# EAGLE schematic improved_circuit_rev3 (EAGLE 7.5.0)

## Sheet 1 of 6
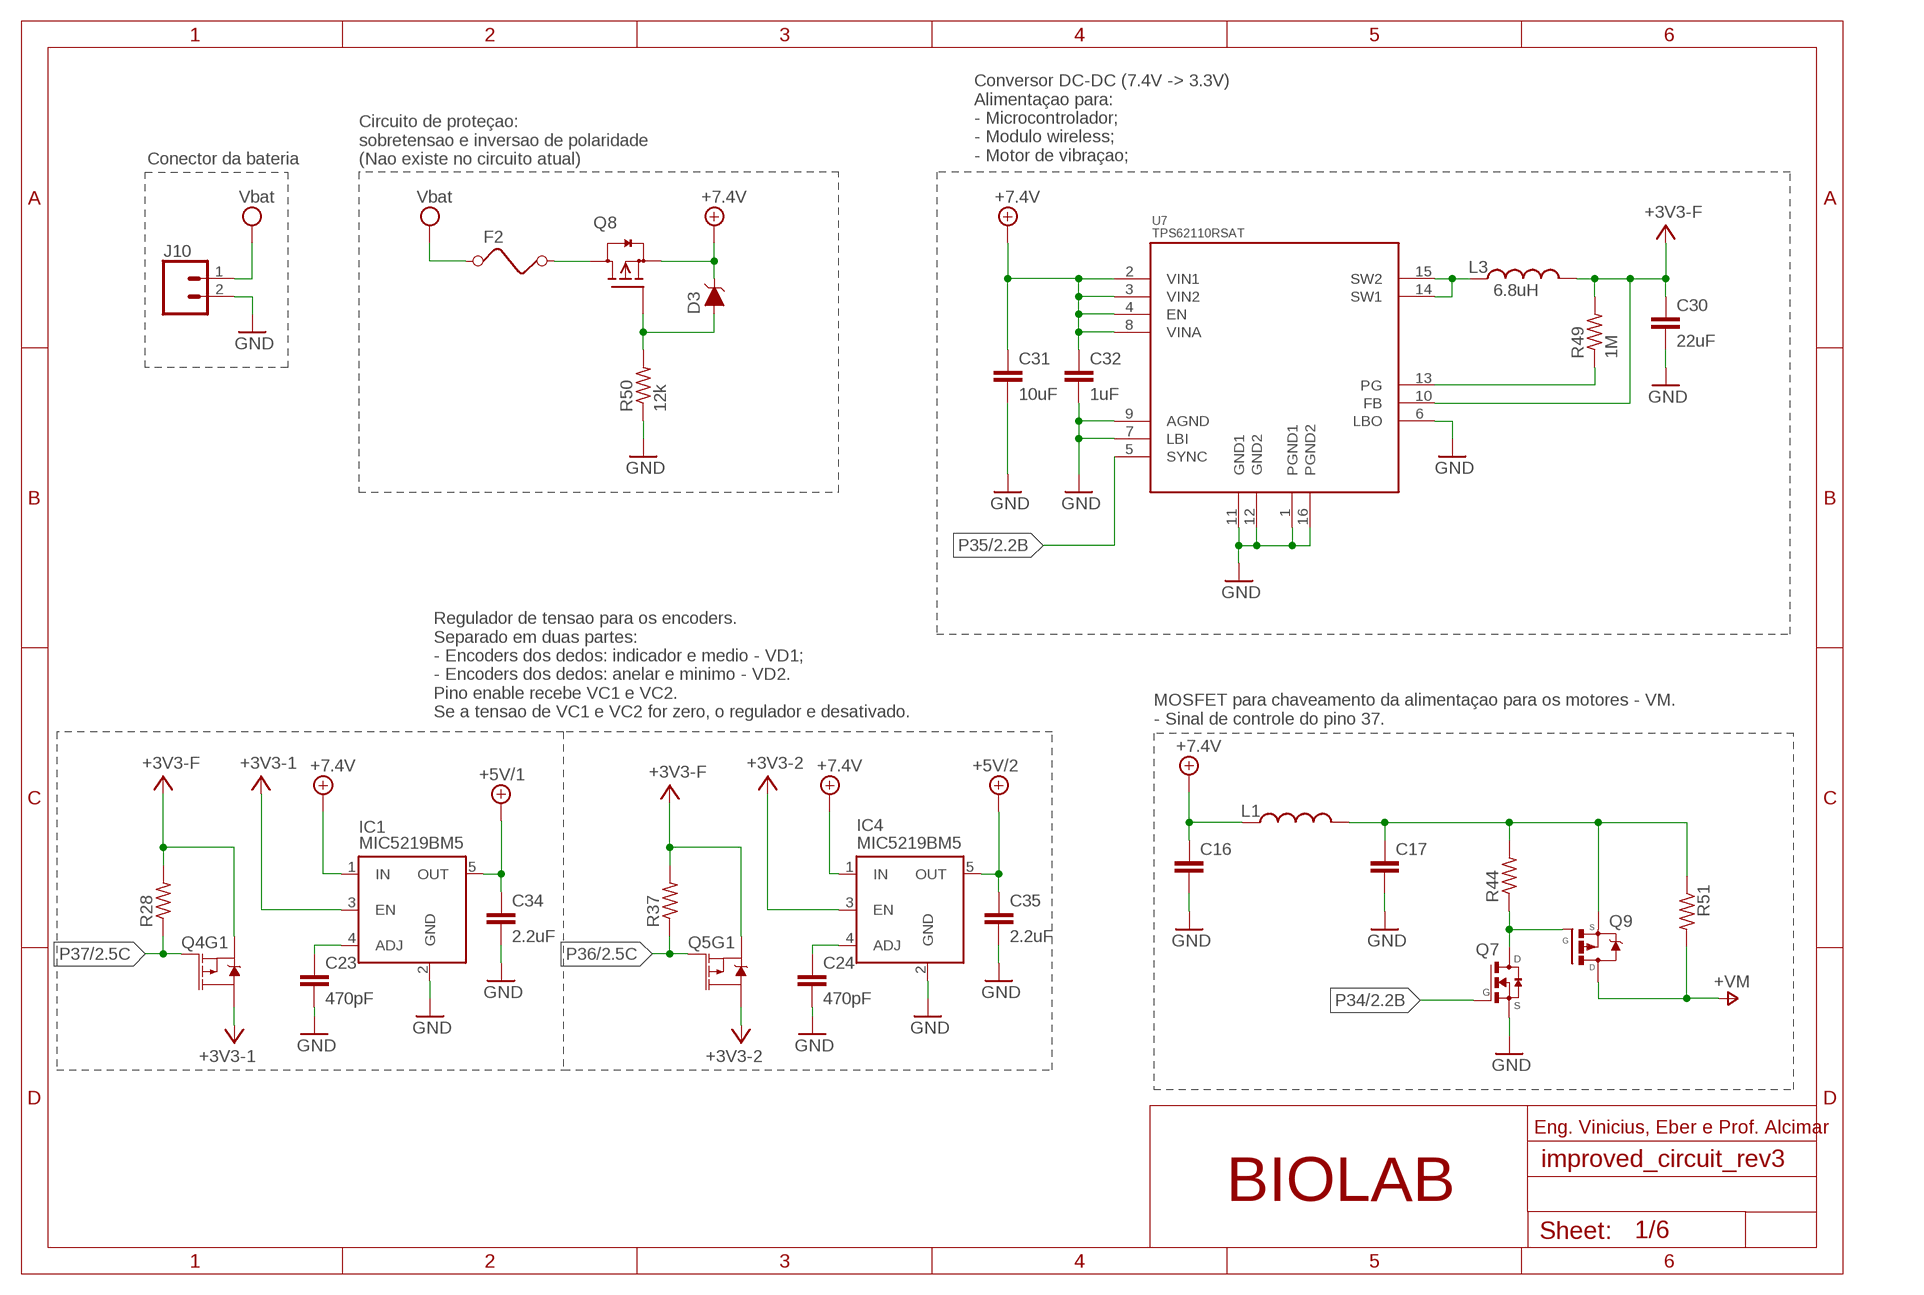
[diagram p0: schematic, sheet 1]

### Parts
C16  C-EUC0805  [C0805]
C17  C-EUC0805  [C0805]
C23  470pF  CAPACITOR_0805_M  [RESC0805_M]
C24  470pF  CAPACITOR_0805_M  [RESC0805_M]
C30  22uF  CAPACITOR_0805_M  [RESC0805_M]
C31  10uF  CAPACITOR_0805_M  [RESC0805_M]
C32  1uF  CAPACITOR_0805_M  [RESC0805_M]
C34  2.2uF  CAPACITOR_0805_M  [RESC0805_M]
C35  2.2uF  CAPACITOR_0805_M  [RESC0805_M]
D3  3.6V  DIODE-ZENER-BZT52C3V6S  [SOD-323]
F2  FUSEF  [1812]
IC1  MIC5219BM5  [SOT23-5]
IC4  MIC5219BM5  [SOT23-5]
J10  CONN_02-JST-2MM-SMT  [JST-2-SMD]
L1  INDUCTOR  [L0603]
L3  6.8uH  INDUCTOR  [L0603]
Q4  2A/20V/150mΩ  MOSFET_PCH_DUAL-DMP2240UDM  [SOT26]
Q5  2A/20V/150mΩ  MOSFET_PCH_DUAL-DMP2240UDM  [SOT26]
Q7  FDV303N  [SOT23]
Q8  BSS84LT1  [SOT23]
Q9  FDS6675  [SO08-E3]
R28  R-US_M0805  [M0805]
R37  R-US_M0805  [M0805]
R44  R-US_M0805  [M0805]
R49  1M  R-US_M0805  [M0805]
R50  12k  R-US_M0805  [M0805]
R51  R-US_M0805  [M0805]
U7  TPS62110RSAT  [QFN16]

### Nets
+3V3: C30.1 IC1.3(EN) IC4.3(EN) L3.2 Q4.S1(S) Q5.S1(S) R28.2 R37.2 R49.2 U7.10(FB) ; supply symbol labelled +3V3-F, +3V3-1, +3V3-2 ; also sheet 2,3,4,5,6
+3V3-1: Q4.D1(D) ; also sheet 4
+3V3-2: Q5.D1(D) ; also sheet 4
+5V/1: C34.1 IC1.5(OUT) ; also sheet 3,4
+5V/2: C35.1 IC4.5(OUT) ; also sheet 4
+7V: C16.1 C31.1 C32.1 D3.C IC1.1(IN) IC4.1(IN) L1.1 Q8.2(S) U7.2(VIN1) U7.3(VIN2) U7.4(EN) U7.8(VINA) ; supply symbol labelled +7.4V ; also sheet 2
GND: C16.2 C17.2 C23.2 C24.2 C30.2 C31.2 C32.2 C34.2 C35.2 IC1.2(GND) IC4.2(GND) J10.2 Q7.2(S) R50.1 U7.1(PGND1) U7.6(LBO) U7.7(LBI) U7.9(AGND) U7.11(GND1) U7.12(GND2) U7.16(PGND2) ; also sheet 2,3,4,5,6
N$9: C17.1 L1.2 Q9.1-3(S) R44.2 R51.1
N$10: Q7.3(D) Q9.4(G) R44.1
N$11: C24.1 IC4.4(ADJ)
N$12: C23.1 IC1.4(ADJ)
N$14: L3.1 U7.14(SW1) U7.15(SW2)
N$15: R49.1 U7.13(PG)
N$16: D3.A Q8.1(G) R50.2
N$18: F2.2 Q8.3(D)
P34: Q7.1(G) ; also sheet 2
P35: U7.5(SYNC) ; also sheet 2
P36: Q5.G1(G) R37.1 ; also sheet 2
P37: Q4.G1(G) R28.1 ; also sheet 2
V+: Q9.5-8(D) R51.2 ; supply symbol labelled +VM ; also sheet 3,4
VCC: F2.1 J10.1 ; supply symbol labelled Vbat
Unconnected: Q4.D2(D) Q4.G2(G) Q4.S2(S) Q5.D2(D) Q5.G2(G) Q5.S2(S)

### Notes on the sheet
- Conversor DC-DC (7.4V -> 3.3V) 
  Alimentaçao para:
  - Microcontrolador;
  - Modulo wireless;
  - Motor de vibraçao;
- Conector da bateria
- Circuito de proteçao: 
  sobretensao e inversao de polaridade
  (Nao existe no circuito atual)
- Regulador de tensao para os encoders.
  Separado em duas partes:
  - Encoders dos dedos: indicador e medio - VD1;
  - Encoders dos dedos: anelar e minimo - VD2.
  Pino enable recebe VC1 e VC2.
  Se a tensao de VC1 e VC2 for zero, o regulador e desativado.
- MOSFET para chaveamento da alimentaçao para os motores - VM.
  - Sinal de controle do pino 37.
- Eng. Vinicius, Eber e Prof. Alcimar
- BIOLAB

## Sheet 2 of 6
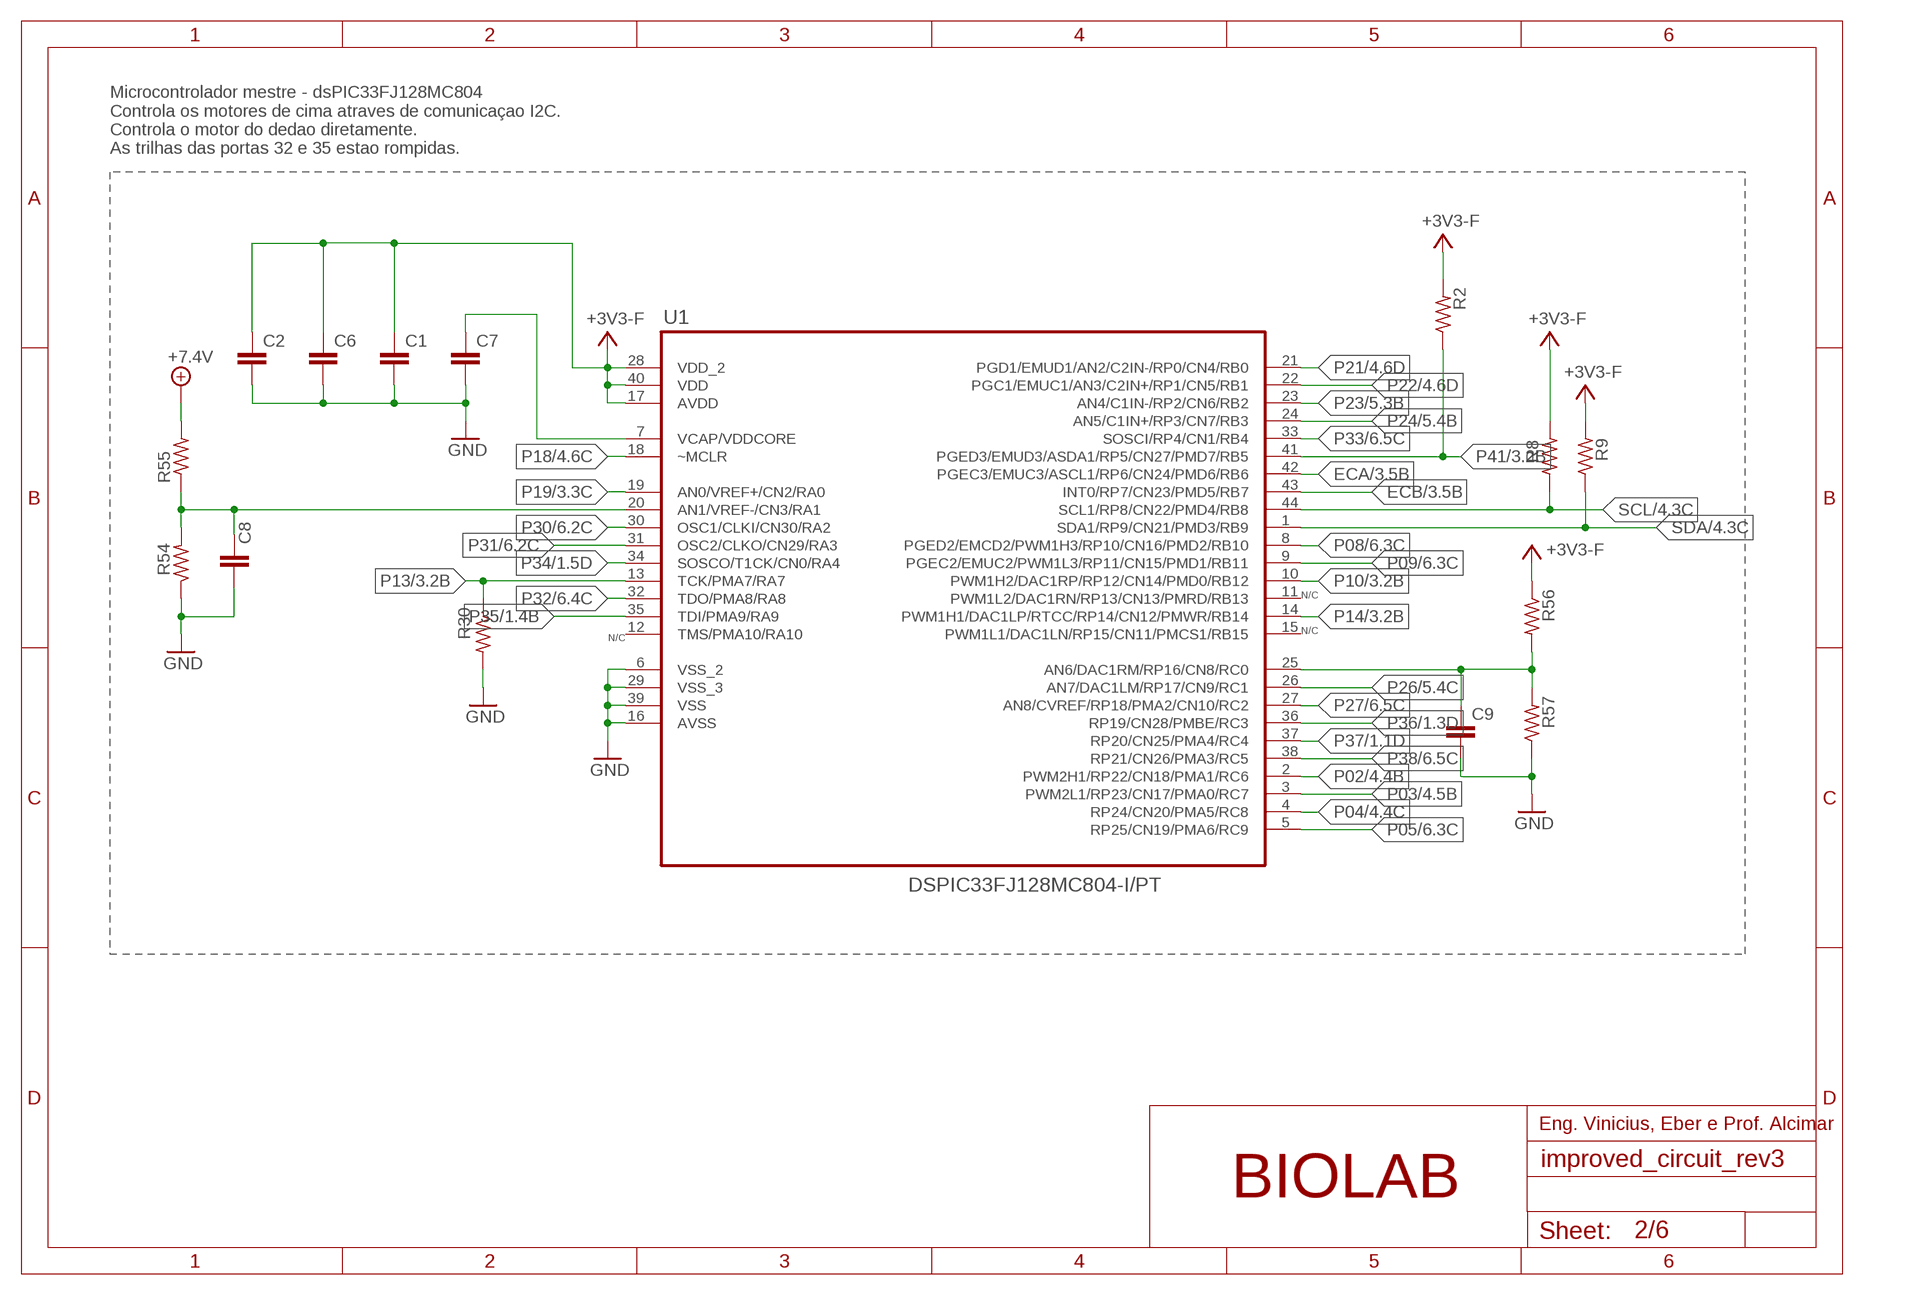
[diagram p1: schematic, sheet 2]

### Parts
C1  CAPACITOR_0805_M  [RESC0805_M]
C2  CAPACITOR_0805_M  [RESC0805_M]
C6  CAPACITOR_0805_M  [RESC0805_M]
C7  CAPACITOR_0805_M  [RESC0805_M]
C8  CAPACITOR_0805_M  [RESC0805_M]
C9  CAPACITOR_0805_M  [RESC0805_M]
R2  R-US_M0805  [M0805]
R8  R-US_M0805  [M0805]
R9  R-US_M0805  [M0805]
R30  R-US_M0805  [M0805]
R54  R-US_M0805  [M0805]
R55  R-US_M0805  [M0805]
R56  R-US_M0805  [M0805]
R57  R-US_M0805  [M0805]
U1  DSPIC33FJ128MC804-I/PT  [QFP80P1200X1200X120-44N]

### Nets
+3V3: C1.1 C2.1 C6.1 R2.2 R8.2 R9.2 R56.1 U1.17(AVDD) U1.28(VDD_2) U1.40(VDD) ; supply symbol labelled +3V3-F ; also sheet 1,3,4,5,6
+7V: R55.2 ; supply symbol labelled +7.4V ; also sheet 1
ECA: U1.42(PGEC3/EMUC3/ASCL1/RP6/CN24/PMD6/RB6) ; also sheet 3
ECB: U1.43(INT0/RP7/CN23/PMD5/RB7) ; also sheet 3
GND: C1.2 C2.2 C6.2 C7.2 C8.2 C9.2 R30.2 R54.1 R57.1 U1.6(VSS_2) U1.16(AVSS) U1.29(VSS_3) U1.39(VSS) ; also sheet 1,3,4,5,6
N$3: C7.1 U1.7(VCAP/VDDCORE)
N$4: C9.1 R56.2 R57.2 U1.25(AN6/DAC1RM/RP16/CN8/RC0)
N$19: C8.1 R54.2 R55.1 U1.20(AN1/VREF-/CN3/RA1)
P02: U1.2(PWM2H1/RP22/CN18/PMA1/RC6) ; also sheet 4
P03: U1.3(PWM2L1/RP23/CN17/PMA0/RC7) ; also sheet 4
P04: U1.4(RP24/CN20/PMA5/RC8) ; also sheet 4
P05: U1.5(RP25/CN19/PMA6/RC9) ; also sheet 6
P08: U1.8(PGED2/EMCD2/PWM1H3/RP10/CN16/PMD2/RB10) ; also sheet 6
P09: U1.9(PGEC2/EMUC2/PWM1L3/RP11/CN15/PMD1/RB11) ; also sheet 6
P10: U1.10(PWM1H2/DAC1RP/RP12/CN14/PMD0/RB12) ; also sheet 3
P13: R30.1 U1.13(TCK/PMA7/RA7) ; also sheet 3
P14: U1.14(PWM1H1/DAC1LP/RTCC/RP14/CN12/PMWR/RB14) ; also sheet 3
P18: U1.18(~MCLR) ; also sheet 4
P19: U1.19(AN0/VREF+/CN2/RA0) ; also sheet 3
P21: U1.21(PGD1/EMUD1/AN2/C2IN-/RP0/CN4/RB0) ; also sheet 4
P22: U1.22(PGC1/EMUC1/AN3/C2IN+/RP1/CN5/RB1) ; also sheet 4
P23: U1.23(AN4/C1IN-/RP2/CN6/RB2) ; also sheet 5
P24: U1.24(AN5/C1IN+/RP3/CN7/RB3) ; also sheet 5
P26: U1.26(AN7/DAC1LM/RP17/CN9/RC1) ; also sheet 5
P27: U1.27(AN8/CVREF/RP18/PMA2/CN10/RC2) ; also sheet 6
P30: U1.30(OSC1/CLKI/CN30/RA2) ; also sheet 6
P31: U1.31(OSC2/CLKO/CN29/RA3) ; also sheet 6
P32: U1.32(TDO/PMA8/RA8) ; also sheet 6
P33: U1.33(SOSCI/RP4/CN1/RB4) ; also sheet 6
P34: U1.34(SOSCO/T1CK/CN0/RA4) ; also sheet 1
P35: U1.35(TDI/PMA9/RA9) ; also sheet 1
P36: U1.36(RP19/CN28/PMBE/RC3) ; also sheet 1
P37: U1.37(RP20/CN25/PMA4/RC4) ; also sheet 1
P38: U1.38(RP21/CN26/PMA3/RC5) ; also sheet 6
P41: R2.1 U1.41(PGED3/EMUD3/ASDA1/RP5/CN27/PMD7/RB5) ; also sheet 3
SCL: R8.1 U1.44(SCL1/RP8/CN22/PMD4/RB8) ; also sheet 4
SDA: R9.1 U1.1(SDA1/RP9/CN21/PMD3/RB9) ; also sheet 4
Unconnected: U1.11(PWM1L2/DAC1RN/RP13/CN13/PMRD/RB13) U1.12(TMS/PMA10/RA10) U1.15(PWM1L1/DAC1LN/RP15/CN11/PMCS1/RB15)

### Notes on the sheet
- Microcontrolador mestre - dsPIC33FJ128MC804
  Controla os motores de cima atraves de comunicaçao I2C.
  Controla o motor do dedao diretamente.
  As trilhas das portas 32 e 35 estao rompidas.
- N/C
- N/C | N/C
- Eng. Vinicius, Eber e Prof. Alcimar
- BIOLAB

## Sheet 3 of 6
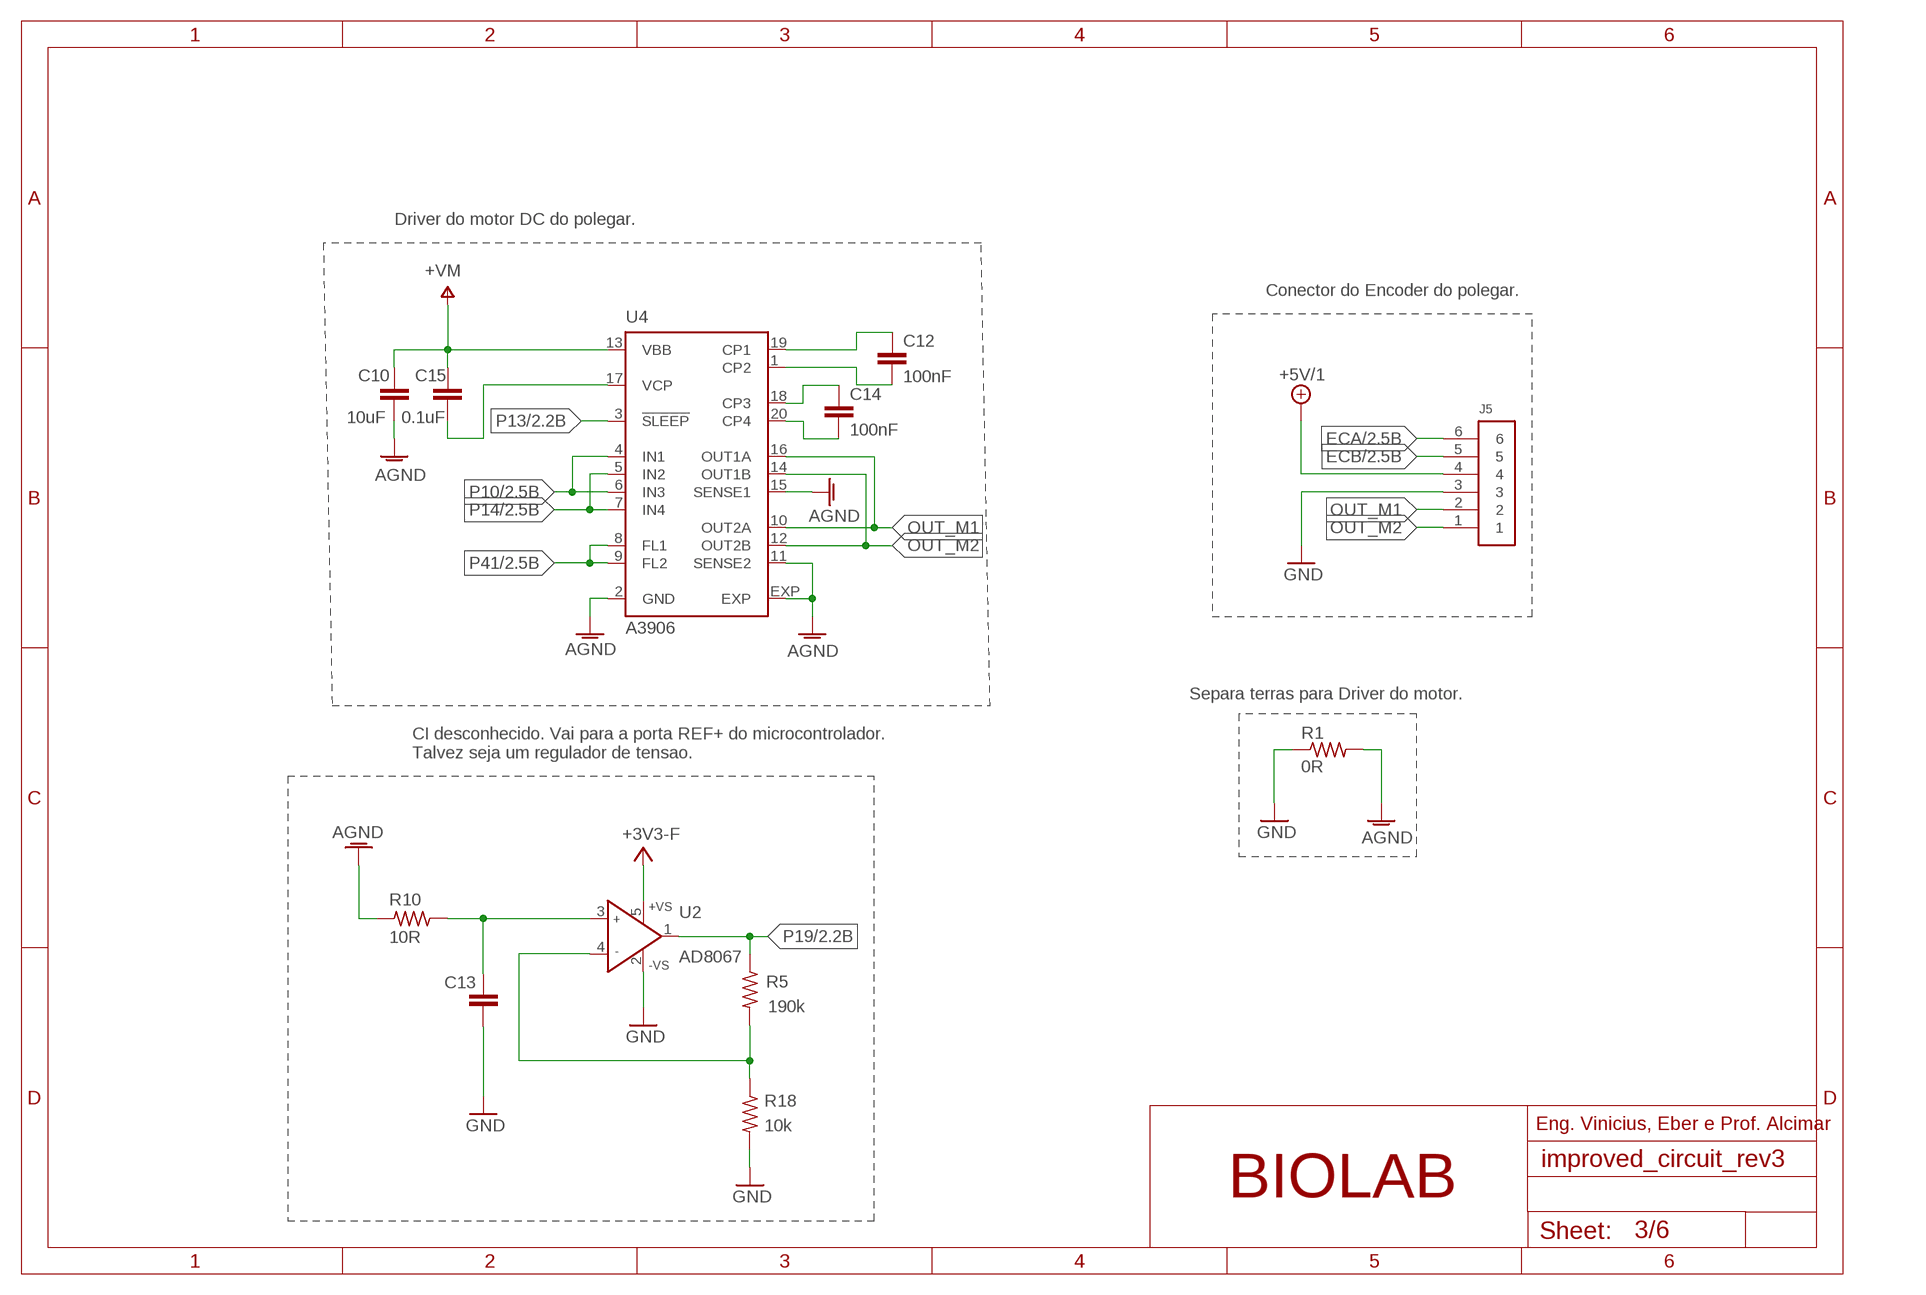
[diagram p2: schematic, sheet 3]

### Parts
C10  10uF  CAPACITOR_0805_M  [RESC0805_M]
C12  100nF  CAPACITOR_0805_M  [RESC0805_M]
C13  CAPACITOR_0805_M  [RESC0805_M]
C14  100nF  CAPACITOR_0805_M  [RESC0805_M]
C15  0.1uF  CAPACITOR_0805_M  [RESC0805_M]
J5  61300611121  [61300611121]
R1  0R  R-US_M0805  [M0805]
R5  190k  R-US_R0805  [R0805]
R10  10R  R-US_R0805  [R0805]
R18  10k  R-US_R0805  [R0805]
U2  AD8067  [SOT23-5]
U4  A3906  [QFN20]

### Nets
+3V3: U2.5(+VS) ; supply symbol labelled +3V3-F ; also sheet 1,2,4,5,6
+5V/1: J5.4 ; also sheet 1,4
AGND: C10.1 R1.2 R10.2 U4.2(GND) U4.11(SENSE2) U4.15(SENSE1) U4.EXP
ECA: J5.6 ; also sheet 2
ECB: J5.5 ; also sheet 2
GND: C13.2 J5.3 R1.1 R18.2 U2.2(-VS) ; also sheet 1,2,4,5,6
N$8: C13.1 R10.1 U2.3(IN+)
N$13: C12.2 U4.1(CP2)
N$17: C14.1 U4.18(CP3)
N$21: C14.2 U4.20(CP4)
N$25: C12.1 U4.19(CP1)
N$26: R5.2 R18.1 U2.4(IN-)
N$27: C15.2 U4.17(VCP)
OUT_M1: J5.2 U4.10(OUT2A) U4.16(OUT1A)
OUT_M2: J5.1 U4.12(OUT2B) U4.14(OUT1B)
P10: U4.4(IN1) U4.6(IN3) ; also sheet 2
P13: U4.3(!SLEEP) ; also sheet 2
P14: U4.5(IN2) U4.7(IN4) ; also sheet 2
P19: R5.1 U2.1(OUT) ; also sheet 2
P41: U4.8(FL1) U4.9(FL2) ; also sheet 2
V+: C10.2 C15.1 U4.13(VBB) ; supply symbol labelled +VM ; also sheet 1,4

### Notes on the sheet
- Driver do motor DC do polegar.
- Conector do Encoder do polegar.
- Separa terras para Driver do motor.
- CI desconhecido. Vai para a porta REF+ do microcontrolador.
  Talvez seja um regulador de tensao.
- Eng. Vinicius, Eber e Prof. Alcimar
- BIOLAB

## Sheet 4 of 6
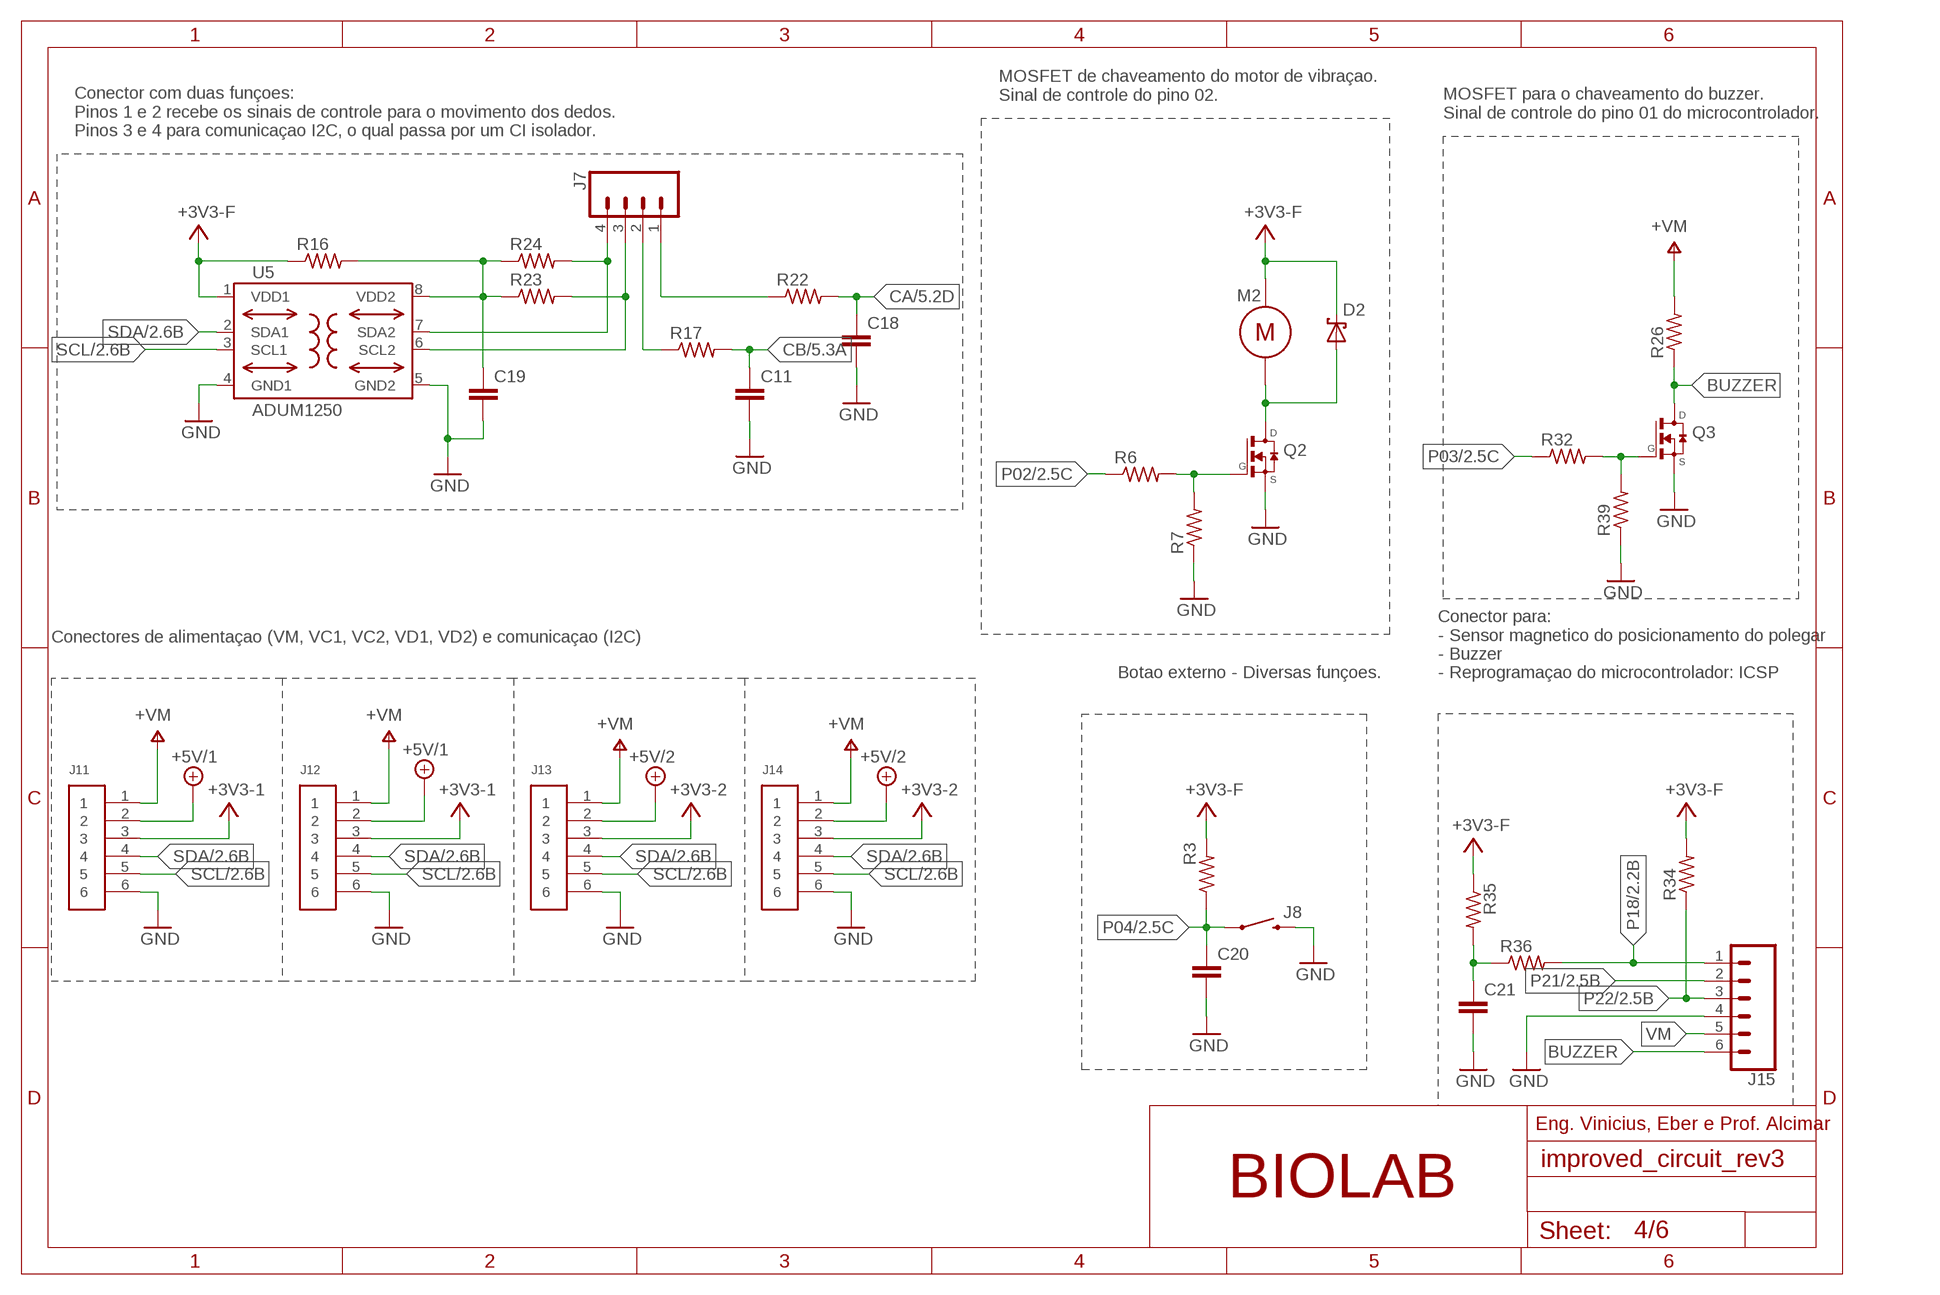
[diagram p3: schematic, sheet 4]

### Parts
C11  CAPACITOR_0805_M  [RESC0805_M]
C18  CAPACITOR_0805_M  [RESC0805_M]
C19  CAPACITOR_0805_M  [RESC0805_M]
C20  CAPACITOR_0805_M  [RESC0805_M]
C21  CAPACITOR_0805_M  [RESC0805_M]
D2  BAS70W,115  [SOT323]
J7  CONN_04SMD2  [1X04_1MM_RA]
J8  RS032G05A3SM-SPST-MOMENTARY-SWSMD-1101NE  [TACTILE-SWITCH-1101NE]
J11  61300611121  [61300611121]
J12  61300611121  [61300611121]
J13  61300611121  [61300611121]
J14  61300611121  [61300611121]
J15  CONN_06SMD-1MM  [1X06-1MM]
M2  308-100  [308-100]
Q2  FDV303N  [SOT23]
Q3  FDV303N  [SOT23]
R3  R-US_M0805  [M0805]
R6  R-US_M0805  [M0805]
R7  R-US_M0805  [M0805]
R16  R-US_M0805  [M0805]
R17  R-US_M0805  [M0805]
R22  R-US_M0805  [M0805]
R23  R-US_M0805  [M0805]
R24  R-US_M0805  [M0805]
R26  R-US_M0805  [M0805]
R32  R-US_M0805  [M0805]
R34  R-US_M0805  [M0805]
R35  R-US_M0805  [M0805]
R36  R-US_M0805  [M0805]
R39  R-US_M0805  [M0805]
U5  ADUM1250  [SO8-COOL]

### Nets
+3V3: D2.3(K) M2.POS R3.2 R16.1 R34.2 R35.1 U5.1(VDD1) ; supply symbol labelled +3V3-F ; also sheet 1,2,3,5,6
+3V3-1: J11.3 J12.3 ; also sheet 1
+3V3-2: J13.3 J14.3 ; also sheet 1
+5V/1: J11.2 J12.2 ; also sheet 1,3
+5V/2: J13.2 J14.2 ; also sheet 1
BUZZER: J15.6 Q3.3(D) R26.1
CA: C18.1 R22.2 ; also sheet 5
CB: C11.1 R17.2 ; also sheet 5
GND: C11.2 C18.2 C19.2 C20.2 C21.2 J8.2 J11.6 J12.6 J13.6 J14.6 J15.4 Q2.2(S) Q3.2(S) R7.1 R39.1 U5.4(GND1) U5.5(GND2) ; also sheet 1,2,3,5,6
N$1: J7.4 R24.2 U5.7(SDA2)
N$2: J7.3 R23.2 U5.6(SCL2)
N$6: Q2.1(G) R6.2 R7.2
N$22: J7.2 R17.1
N$23: J7.1 R22.1
N$24: C21.1 R35.2 R36.1
N$28: D2.1(A) M2.NEG Q2.3(D)
N$29: Q3.1(G) R32.2 R39.2
N$39: C19.1 R16.2 R23.1 R24.1 U5.8(VDD2)
P02: R6.1 ; also sheet 2
P03: R32.1 ; also sheet 2
P04: C20.1 J8.1 R3.1 ; also sheet 2
P18: J15.1 R36.2 ; also sheet 2
P21: J15.2 ; also sheet 2
P22: J15.3 R34.1 ; also sheet 2
SCL: J11.5 J12.5 J13.5 J14.5 U5.3(SCL1) ; also sheet 2
SDA: J11.4 J12.4 J13.4 J14.4 U5.2(SDA1) ; also sheet 2
V+: J11.1 J12.1 J13.1 J14.1 R26.2 ; supply symbol labelled +VM ; also sheet 1,3
VM: J15.5

### Notes on the sheet
- MOSFET de chaveamento do motor de vibraçao.
  Sinal de controle do pino 02.
- MOSFET para o chaveamento do buzzer.
  Sinal de controle do pino 01 do microcontrolador.
- Conector com duas funçoes:
  Pinos 1 e 2 recebe os sinais de controle para o movimento dos dedos.
  Pinos 3 e 4 para comunicaçao I2C, o qual passa por um CI isolador.
- Conectores de alimentaçao (VM, VC1, VC2, VD1, VD2) e comunicaçao (I2C)
- Botao externo - Diversas funçoes.
- Conector para:
  - Sensor magnetico do posicionamento do polegar
  - Buzzer
  - Reprogramaçao do microcontrolador: ICSP
- Eng. Vinicius, Eber e Prof. Alcimar
- BIOLAB

## Sheet 5 of 6
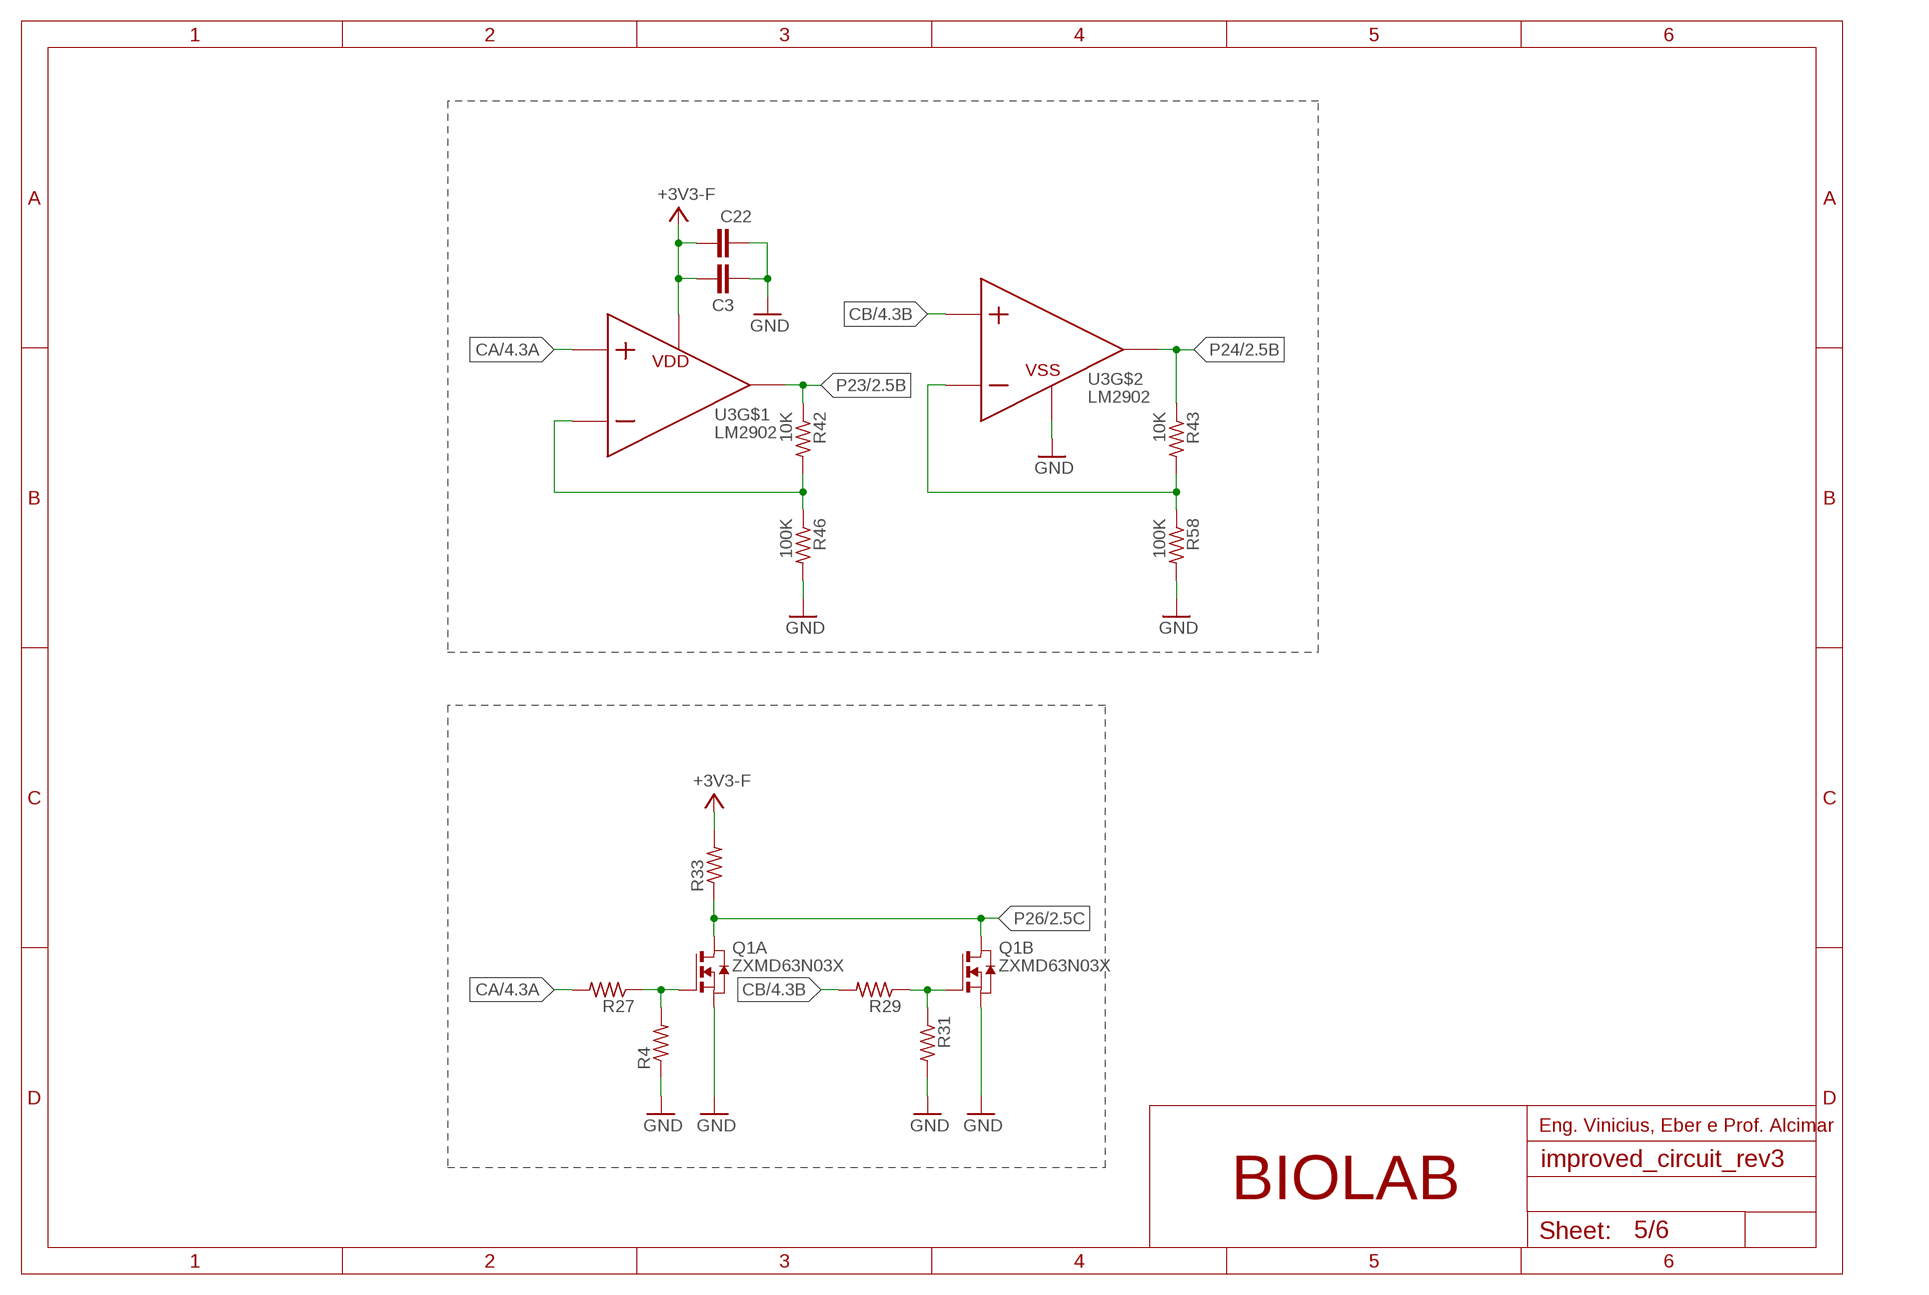
[diagram p4: schematic, sheet 5]

### Parts
C3  CAPACITOR_0805_M  [RESC0805_M]
C22  CAPACITOR_0805_M  [RESC0805_M]
Q1  ZXMD63N03X  [MSOP8]
R4  R-US_M0805  [M0805]
R27  R-US_M0805  [M0805]
R29  R-US_M0805  [M0805]
R31  R-US_M0805  [M0805]
R33  R-US_M0805  [M0805]
R42  10K  R-US_M0805  [M0805]
R43  10K  R-US_M0805  [M0805]
R46  100K  R-US_M0805  [M0805]
R58  100K  R-US_M0805  [M0805]
U3  LM2902  [TSSOP8]

### Nets
+3V3: C3.1 C22.1 R33.2 U3.8(VDD) ; supply symbol labelled +3V3-F ; also sheet 1,2,3,4,6
CA: R27.2 U3.3(P) ; also sheet 4
CB: R29.2 U3.5(P1) ; also sheet 4
GND: C3.2 C22.2 Q1.1(A:S) Q1.3(B:S) R4.1 R31.2 R46.2 R58.2 U3.4(VSS) ; also sheet 1,2,3,4,6
N$5: Q1.2(A:G) R4.2 R27.1
N$7: Q1.4(B:G) R29.1 R31.1
N$30: R42.2 R46.1 U3.2(N)
N$31: R43.2 R58.1 U3.6(N1)
P23: R42.1 U3.1(VOUT) ; also sheet 2
P24: R43.1 U3.7(VOUT1) ; also sheet 2
P26: Q1.5(B:D) Q1.6(B:D) Q1.7(A:D) Q1.8(A:D) R33.1 ; also sheet 2

### Notes on the sheet
- Eng. Vinicius, Eber e Prof. Alcimar
- BIOLAB

## Sheet 6 of 6
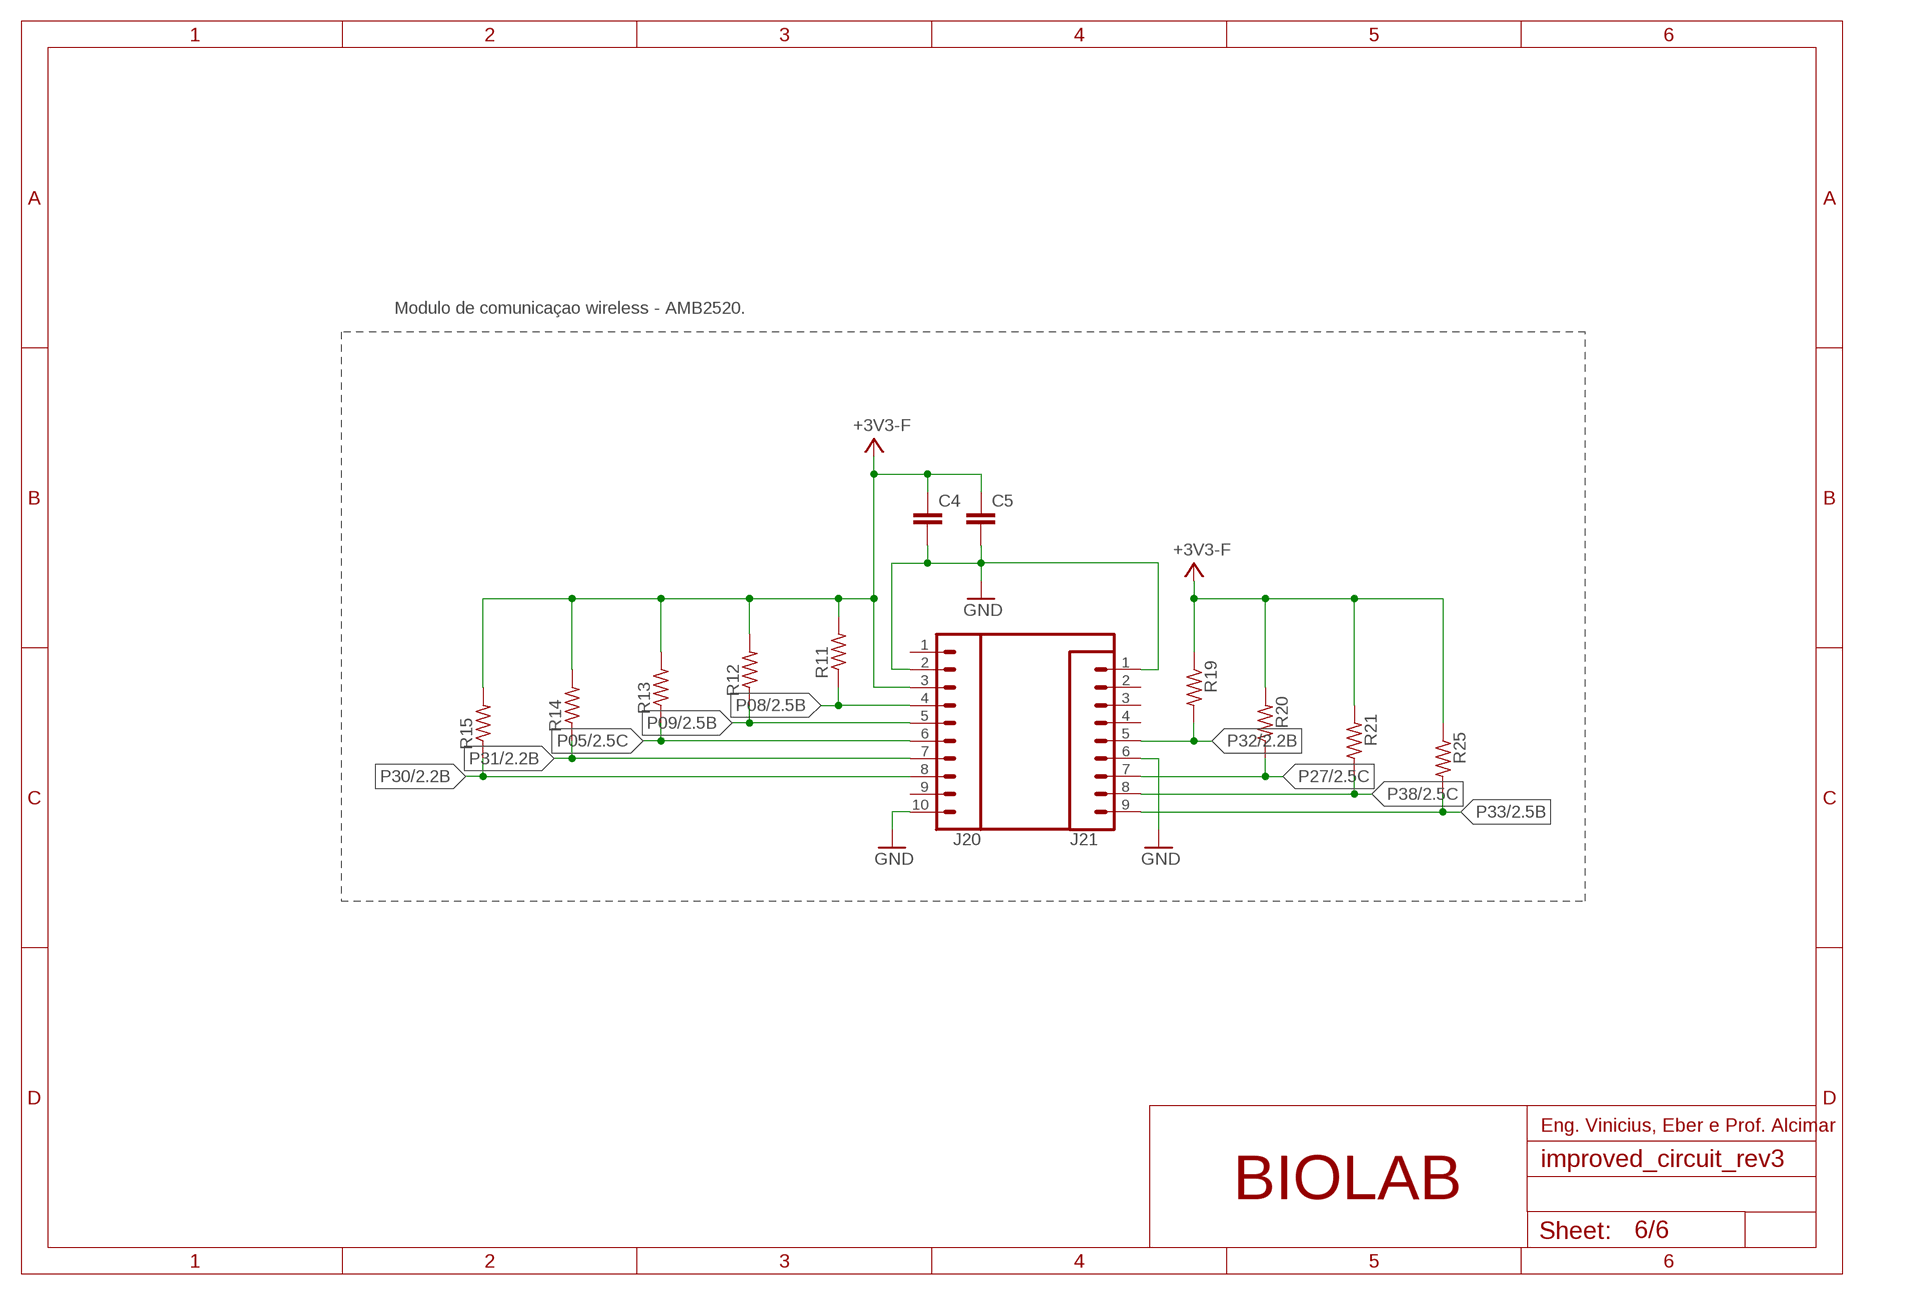
[diagram p5: schematic, sheet 6]

### Parts
C4  CAPACITOR_0805_M  [RESC0805_M]
C5  CAPACITOR_0805_M  [RESC0805_M]
J20  CONN_10"  [1X10]
J21  CONN_09  [1X09]
R11  R-US_M0805  [M0805]
R12  R-US_M0805  [M0805]
R13  R-US_M0805  [M0805]
R14  R-US_M0805  [M0805]
R15  R-US_M0805  [M0805]
R19  R-US_M0805  [M0805]
R20  R-US_M0805  [M0805]
R21  R-US_M0805  [M0805]
R25  R-US_M0805  [M0805]

### Nets
+3V3: C4.1 C5.1 J20.3 R11.2 R12.2 R13.2 R14.2 R15.2 R19.1 R20.2 R21.2 R25.1 ; supply symbol labelled +3V3-F ; also sheet 1,2,3,4,5
GND: C4.2 C5.2 J20.2 J20.10 J21.1 J21.6 ; also sheet 1,2,3,4,5
P05: J20.6 R13.1 ; also sheet 2
P08: J20.4 R11.1 ; also sheet 2
P09: J20.5 R12.1 ; also sheet 2
P27: J21.7 R20.1 ; also sheet 2
P30: J20.8 R15.1 ; also sheet 2
P31: J20.7 R14.1 ; also sheet 2
P32: J21.5 R19.2 ; also sheet 2
P33: J21.9 R25.2 ; also sheet 2
P38: J21.8 R21.1 ; also sheet 2
Unconnected: J20.1 J20.9 J21.2 J21.3 J21.4

### Notes on the sheet
- Modulo de comunicaçao wireless - AMB2520.
- Eng. Vinicius, Eber e Prof. Alcimar
- BIOLAB

## Library data of the parts
C1-C15 C18-C24 C30-C32 C34 C35 = Nordic_nRF:CAPACITOR: Generic chip capacitor
C16 C17 = rcl:C-EU: CAPACITOR, European symbol; SPICEPREFIX: C
D2 = BAS70W_115:BAS70W,115: General-purpose Schottky diode General-purpose Schottky diodes in small Surface-Mounted Device (SMD) plastic packages. AAL Eindhoven MK; AVAILABILITY: Unavailable; DESCRIPTION: Diode Schottky 70V 70mA _DC_ Surface Mount SC-70; MF: Nexperia USA; MP: BAS70W,115; PACKAGE: SOT-323 NXP Semiconductors; PRICE: None
D3 = SparkFun-DiscreteSemi:DIODE-ZENER: Zener Diode A Zener diode allows current to flow from its anode to its cathode like a normal semiconductor diode, but it also permits current to flow in the reverse direction when its "Zener voltage" is reached. - WIkipedia; PROD_ID: DIO-08199
F2 = m-pad-2.1:FUSE: Fuse's in various packages
IC1 IC4 = v-reg-micrel:MIC5219BM5: VOLTAGE REGULATOR; MF: ALTERA CORPORATION; MPN: MIC5219BM5 TR; OC_FARNELL: 1100656; OC_NEWARK: 09J8939
J5 J11-J14 = Headers:61300611121: CONN HEADER VERT 6POS 2.54MM Manufacturer's datasheet <https://katalog.we-online.de/em/datasheet/6130xx11121.pdf>; CREATED_BY: PCBLayout.com; DIGI_KEY_PART_NUMBER: 732-5319-ND; MANUFACTURER: Wurth Electronics Inc.; MPN: 61300611121
J7 = SparkFun-Connectors:CONN_04: Multi connection point. Often used as Generic Header-pin footprint for 0.1 inch spaced/style header connections On any of the 0.1 inch spaced packages, you can populate with these: Break Away Headers - Straight <https://www.sparkfun.com/products/116> (PRT-00116) Break Away Male Headers - Right Angle <https://www.sparkfun.com/products/553> (PRT-00553) Female Headers <https://www.sparkfun.com/products/115> (PRT-00115) Break Away Headers - Machine Pin <https://www.sparkfun.com/products/117> (PRT-00117) Break Away Female Headers - Swiss Machine Pin <https://www.sparkfun.com/products/743> (PRT-00743) For SCREWTERMINALS and SPRING TERMINALS visit here: Screw Terimnals on SparkFun.com <https://www.sparkfun.com/search/results?term=Screw+Terminals> (5mm/3.5mm/2.54mm spacing) This device is also useful as a general connection point to wire up your design to another part of your project. Our various solder wires solder well into these plated through hole pads. Hook-Up Wire - Assortment (Stranded, 22 AWG) <https://www.sparkfun.com/products/11375> (PRT-11375) Hook-Up Wire - Assortment (Solid Core, 22 AWG) <https://www.sparkfun.com/products/11367> (PRT-11367) View the entire wire category on our website here <https://www.sparkfun.com/categories/141> Special notes: Molex polarized connector foot print use with SKU : PRT-08231 with associated crimp pins and housings. 1MM SMD Version SKU: PRT-10208; PROD_ID: CONN-10310; SF_ID: PRT-10208
J8 = BeagleBone_Blue_R3:RS032G05A3SM-SPST-MOMENTARY-SW: 6x3.5mm 2-pin Momentary Switch (Push-button) Digikey Link <https://www.digikey.com/products/en?keywords=CKN10388TR-ND> Datasheet <https://media.digikey.com/pdf/Data%20Sheets/C&K/RS-032G05_-SM_RT.pdf>; PROD_ID: SWCH-00815
J10 = SparkFun-Connectors:CONN_02: Multi connection point. Often used as Generic Header-pin footprint for 0.1 inch spaced/style header connections On any of the 0.1 inch spaced packages, you can populate with these: Break Away Headers - Straight <https://www.sparkfun.com/products/116> (PRT-00116) Break Away Male Headers - Right Angle <https://www.sparkfun.com/products/553> (PRT-00553) Female Headers <https://www.sparkfun.com/products/115> (PRT-00115) Break Away Headers - Machine Pin <https://www.sparkfun.com/products/117> (PRT-00117) Break Away Female Headers - Swiss Machine Pin <https://www.sparkfun.com/products/743> (PRT-00743) For SCREWTERMINALS and SPRING TERMINALS visit here: Screw Terimnals on SparkFun.com <https://www.sparkfun.com/search/results?term=Screw+Terminals> (5mm/3.5mm/2.54mm spacing) This device is also useful as a general connection point to wire up your design to another part of your project. Our various solder wires solder well into these plated through hole pads. Hook-Up Wire - Assortment (Stranded, 22 AWG) <https://www.sparkfun.com/products/11375> (PRT-11375) Hook-Up Wire - Assortment (Solid Core, 22 AWG) <https://www.sparkfun.com/products/11367> (PRT-11367) View the entire wire category on our website here <https://www.sparkfun.com/categories/141> Special notes: Molex polarized connector foot print use with: PRT-08233 with associated crimp pins and housings. 2.54_SCREWTERM for use with PRT-10571. 3.5mm Screw Terminal footprints for PRT-08084 5mm Screw Terminal footprints for use with PRT-08432; PROD_ID: CONN-11443
J15 = SparkFun-Connectors:CONN_06: Multi connection point. Often used as Generic Header-pin footprint for 0.1 inch spaced/style header connections On any of the 0.1 inch spaced packages, you can populate with these: Break Away Headers - Straight <https://www.sparkfun.com/products/116> (PRT-00116) Break Away Male Headers - Right Angle <https://www.sparkfun.com/products/553> (PRT-00553) Female Headers <https://www.sparkfun.com/products/115> (PRT-00115) Break Away Headers - Machine Pin <https://www.sparkfun.com/products/117> (PRT-00117) Break Away Female Headers - Swiss Machine Pin <https://www.sparkfun.com/products/743> (PRT-00743) Arduino Stackable Header - 6 Pin <https://www.sparkfun.com/products/9280> (PRT-09280) For SCREWTERMINALS and SPRING TERMINALS visit here: Screw Terimnals on SparkFun.com <https://www.sparkfun.com/search/results?term=Screw+Terminals> (5mm/3.5mm/2.54mm spacing) This device is also useful as a general connection point to wire up your design to another part of your project. Our various solder wires solder well into these plated through hole pads. Hook-Up Wire - Assortment (Stranded, 22 AWG) <https://www.sparkfun.com/products/11375> (PRT-11375) Hook-Up Wire - Assortment (Solid Core, 22 AWG) <https://www.sparkfun.com/products/11367> (PRT-11367) View the entire wire category on our website here <https://www.sparkfun.com/categories/141>; PROD_ID: CONN-08249; SF_ID: GPS-00579
J20 = SparkFun-Connectors:CONN_10: Multi connection point. Often used as Generic Header-pin footprint for 0.1 inch spaced/style header connections On any of the 0.1 inch spaced packages, you can populate with these: Break Away Headers - Straight <https://www.sparkfun.com/products/116> (PRT-00116) Break Away Male Headers - Right Angle <https://www.sparkfun.com/products/553> (PRT-00553) Female Headers <https://www.sparkfun.com/products/115> (PRT-00115) Break Away Headers - Machine Pin <https://www.sparkfun.com/products/117> (PRT-00117) Break Away Female Headers - Swiss Machine Pin <https://www.sparkfun.com/products/743> (PRT-00743) Arduino Stackable Header - 10 Pin <https://www.sparkfun.com/products/11376> (PRT-11376) For SCREWTERMINALS and SPRING TERMINALS visit here: Screw Terimnals on SparkFun.com <https://www.sparkfun.com/search/results?term=Screw+Terminals> (5mm/3.5mm/2.54mm spacing) This device is also useful as a general connection point to wire up your design to another part of your project. Our various solder wires solder well into these plated through hole pads. Hook-Up Wire - Assortment (Stranded, 22 AWG) <https://www.sparkfun.com/products/11375> (PRT-11375) Hook-Up Wire - Assortment (Solid Core, 22 AWG) <https://www.sparkfun.com/products/11367> (PRT-11367) View the entire wire category on our website here <https://www.sparkfun.com/categories/141> Special notes: Molex polarized connector foot print use with SKU : PRT-08231 with associated crimp pins and housings. 1MM SMD Version SKU: PRT-10208 NOTES ON THE VARIANTS LOCK and LOCK_LONGPADS... This footprint was designed to help hold the alignment of a through-hole component (i.e. 6-pin header) while soldering it into place. You may notice that each hole has been shifted either up or down by 0.005 of an inch from it's more standard position (which is a perfectly straight line). This slight alteration caused the pins (the squares in the middle) to touch the edges of the holes. Because they are alternating, it causes a "brace" to hold the component in place. 0.005 has proven to be the perfect amount of "off-center" position when using our standard breakaway headers. Although looks a little odd when you look at the bare footprint, once you have a header in there, the alteration is very hard to notice. Also,if you push a header all the way into place, it is covered up entirely on the bottom side.; PROD_ID: CONN-11563
J21 = SparkFun-Connectors:CONN_09: Multi connection point. Often used as Generic Header-pin footprint for 0.1 inch spaced/style header connections On any of the 0.1 inch spaced packages, you can populate with these: Break Away Headers - Straight <https://www.sparkfun.com/products/116> (PRT-00116) Break Away Male Headers - Right Angle <https://www.sparkfun.com/products/553> (PRT-00553) Female Headers <https://www.sparkfun.com/products/115> (PRT-00115) Break Away Headers - Machine Pin <https://www.sparkfun.com/products/117> (PRT-00117) Break Away Female Headers - Swiss Machine Pin <https://www.sparkfun.com/products/743> (PRT-00743) For SCREWTERMINALS and SPRING TERMINALS visit here: Screw Terimnals on SparkFun.com <https://www.sparkfun.com/search/results?term=Screw+Terminals> (5mm/3.5mm/2.54mm spacing) This device is also useful as a general connection point to wire up your design to another part of your project. Our various solder wires solder well into these plated through hole pads. Hook-Up Wire - Assortment (Stranded, 22 AWG) <https://www.sparkfun.com/products/11375> (PRT-11375) Hook-Up Wire - Assortment (Solid Core, 22 AWG) <https://www.sparkfun.com/products/11367> (PRT-11367) View the entire wire category on our website here <https://www.sparkfun.com/categories/141> Special notes: Molex polarized connector foot print use with SKU : PRT-08231 with associated crimp pins and housings. 1MM SMD Version SKU: PRT-10208 NOTES ON THE VARIANTS LOCK and LOCK_LONGPADS... This footprint was designed to help hold the alignment of a through-hole component (i.e. 6-pin header) while soldering it into place. You may notice that each hole has been shifted either up or down by 0.005 of an inch from it's more standard position (which is a perfectly straight line). This slight alteration caused the pins (the squares in the middle) to touch the edges of the holes. Because they are alternating, it causes a "brace" to hold the component in place. 0.005 has proven to be the perfect amount of "off-center" position when using our standard breakaway headers. Although looks a little odd when you look at the bare footprint, once you have a header in there, the alteration is very hard to notice. Also,if you push a header all the way into place, it is covered up entirely on the bottom side.
L1 L3 = BeagleBone_Blue_R3:INDUCTOR: Inductors Basic Inductor/Choke - 0603 and 1206. Footprints are not proven and vary greatly between part numbers. SRN6045- 33uH, 20% 1.4A
M2 = motor:308-100: Pico Vibe 8mm Vibration Motor - 3mm Type; PRECISION_MICRODRIVES: 308-100
Q1 = zetex:ZXMD63N03X: DUAL 30V N-CHANNEL ENHANCEMENT MODE MOSFET Source: Data sheet <http://www.diodes.com/datasheets/ZXMD63N03X.pdf>; OC_FARNELL: unknown; OC_NEWARK: unknown
Q2 Q3 Q7 = FDV303N:FDV303N: Digital FET, N-Channel; AVAILABILITY: Unavailable; DESCRIPTION: FD V303N Series N-Channel 25 V 0.45 Ohm Surface Mount Digital FET - SOT-23-3; MF: Fairchild Semiconductor; MP: FDV303N.; PACKAGE: SOT-23-3 Fairchild Semiconductor; PRICE: None
Q4 Q5 = SparkFun-DiscreteSemi:MOSFET_PCH_DUAL: Dual P-Channel -20VDS MOSFET Link to datasheet <http://www.diodes.com/_files/datasheets/ds31197.pdf> SparkFun Products: SparkFun FreeSoC2 Development Board <https://www.sparkfun.com/products/13229>; PROD_ID: TRANS-12444
Q8 = m-pad-2.1:BSS84LT1: OnSemi's BSS84LT1 Power MOSFET 130 mA, 50 V RDS(on) = 10 P-Channel SOT-23 Description: These miniature surface mount MOSFETs reduce power loss conserve energy, making this device ideal for use in small power management circuitry. Typical applications are DC/DC converters, load switching, power management in portable and battery-powered products such as computers, printers, cellular and cordless telephones. Features: Energy Efficient Miniature SOT-23 Surface Mount Package Saves Board Space Pb-Free Package is Available Please send any comments to: messi@users.sourceforge.net
Q9 = FDS6675BZ:FDS6675: P-Channel MOSFET Logic Level, PowerTrenchTM; AVAILABILITY: Unavailable; DESCRIPTION: P-Channel 30 V 14 mOhm Logic Level PowerTrench Mosfet - SOIC-8; MF: ON Semiconductor; MP: FDS6675; PACKAGE: SOIC-8 Fairchild Semiconductor; PRICE: None
R1-R37 R39 R42-R44 R46 R49-R51 R54-R58 = BeagleBone_Black_Wireless:R-US_: RESISTOR, American symbol
U1 = DSPIC33FJ128MC804-I_PT:DSPIC33FJ128MC804-I/PT: Digital Signal Controllers; AVAILABILITY: Unavailable; DESCRIPTION: dsPIC dsPIC™ 33F Microcontroller IC 16-Bit 40 MIPs 128KB _128K x 8_ FLASH 44-TQFP _10x10_; MF: Microchip; MP: DSPIC33FJ128MC804-I/PT; PACKAGE: TQFP-44 Microchip; PRICE: None
U2 = analog-devices:AD8067: High Gain Bandwidth, Precision Fast FET(TM) Op Amp Source: http://www.analog.com/UploadedFiles/Data_Sheets/346131962AD8067_a.pdf; MF: ALTERA CORPORATION; MPN: AD8067ARTZ-REEL7; OC_FARNELL: 1464848; OC_NEWARK: 59K6326
U3 = LM2902:LM2902
U4 = allegro:A3906: Low Voltage Stepper and Single/Dual DC Motor Driver Data Sheet <http://www.allegromicro.com/en/Products/Part_Numbers/3906/3906.pdf>
U5 = ADUM1250:ADUM1250: Hot Swappable, Dual I2C Isolators Source: http://www.analog.com/static/imported-files/data_sheets/ADUM1250_1251.pdf; AVAILABILITY: Unavailable; DESCRIPTION: I²C Digital Isolator 2500Vrms 2 Channel 1Mbps 25kV/µs CMTI 8-SOIC _0.154, 3.90mm Width_; MF: Analog Devices; MP: ADUM1250; PACKAGE: SOIC-8 Analog Devices; PRICE: None
U7 = TPS62110RSAT:TPS62110RSAT